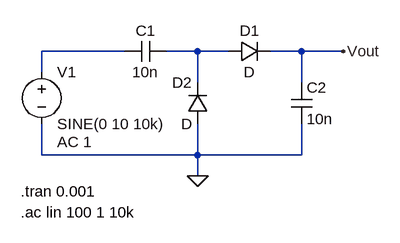
[diagram p0: schematic Voltage_doubler_1.asc]
Voltage_doubler_1.asc, the LTspice schematic file:
Version 4
SHEET 1 880 680
WIRE 112 112 -16 112
WIRE 224 112 176 112
WIRE 272 112 224 112
WIRE 384 112 336 112
WIRE 448 112 384 112
WIRE -16 144 -16 112
WIRE 224 160 224 112
WIRE 384 160 384 112
WIRE -16 272 -16 224
WIRE 224 272 224 224
WIRE 224 272 -16 272
WIRE 384 272 384 224
WIRE 384 272 224 272
WIRE 224 304 224 272
FLAG 224 304 0
FLAG 448 112 Vout
SYMBOL cap 176 96 R90
WINDOW 0 0 32 VBottom 2
WINDOW 3 32 32 VTop 2
SYMATTR InstName C1
SYMATTR Value 10n
SYMBOL cap 368 160 R0
SYMATTR InstName C2
SYMATTR Value 10n
SYMBOL diode 272 128 R270
WINDOW 0 32 32 VTop 2
WINDOW 3 0 32 VBottom 2
SYMATTR InstName D1
SYMBOL diode 240 224 R180
WINDOW 0 24 64 Left 2
WINDOW 3 24 0 Left 2
SYMATTR InstName D2
SYMBOL voltage -16 128 R0
WINDOW 123 24 124 Left 2
WINDOW 39 0 0 Left 0
SYMATTR Value2 AC 1
SYMATTR InstName V1
SYMATTR Value SINE(0 10 10k)
TEXT -48 328 Left 2 !.tran 0.001
TEXT -48 360 Left 2 !.ac lin 100 1 10k

The netlist it stands for:
* Voltage_doubler_1.asc
C1 N002 N001 10n
C2 Vout 0 10n
D1 N002 Vout D
D2 0 N002 D
V1 N001 0 SINE(0 10 10k) AC 1
.model D D
.lib standard.dio
.tran 0.001
.ac lin 100 1 10k
.backanno
.end